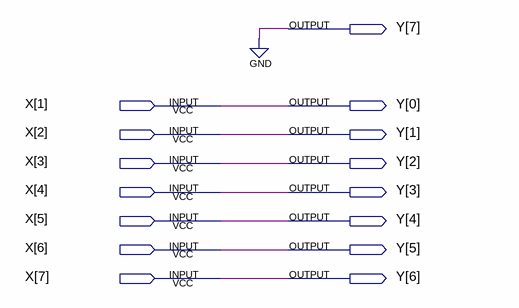
[diagram p0: schematic sheet]
// Quartus schematic Shifter1bit.bdf as structural Verilog: 0 symbols, 15 pins
module Shifter1bit (
  input  [7:1] X,
  output [7:0] Y
);


  assign Y = {1'b0, X};
endmodule
